# Altium schematic sheet qdr2_3.SchDoc: Virtex-6 QDRs 2 & 3
size A3; Date: DO NOT USE, RATHER USE PROJ OPTIONS; DrawnBy: DO NOT USE, RATHER USE PROJ OPTIONS; Engineer: DO NOT USE, RATHER USE PROJ OPTIONS; Organization: DO NOT USE, RATHER USE PROJ OPTIONS; DocumentNumber: DO NOT USE, RATHER USE PROJ OPTIONS; Revision: DO NOT USE, RATHER USE PROJ OPTIONS; SheetNumber: 20; SheetTotal: 27; SCH_Sheet_Filename: qdr2_3.SchDoc; CurrentTime: DO NOT USE, RATHER USE PROJ OPTIONS; Time: DO NOT USE, RATHER USE PROJ OPTIONS; DocumentFullPathAndName: DO NOT USE, RATHER USE PROJ OPTIONS; DocumentName: DO NOT USE, RATHER USE PROJ OPTIONS; ModifiedDate: DO NOT USE, RATHER USE PROJ OPTIONS; ImagePath: DO NOT USE, RATHER USE PROJ OPTIONS
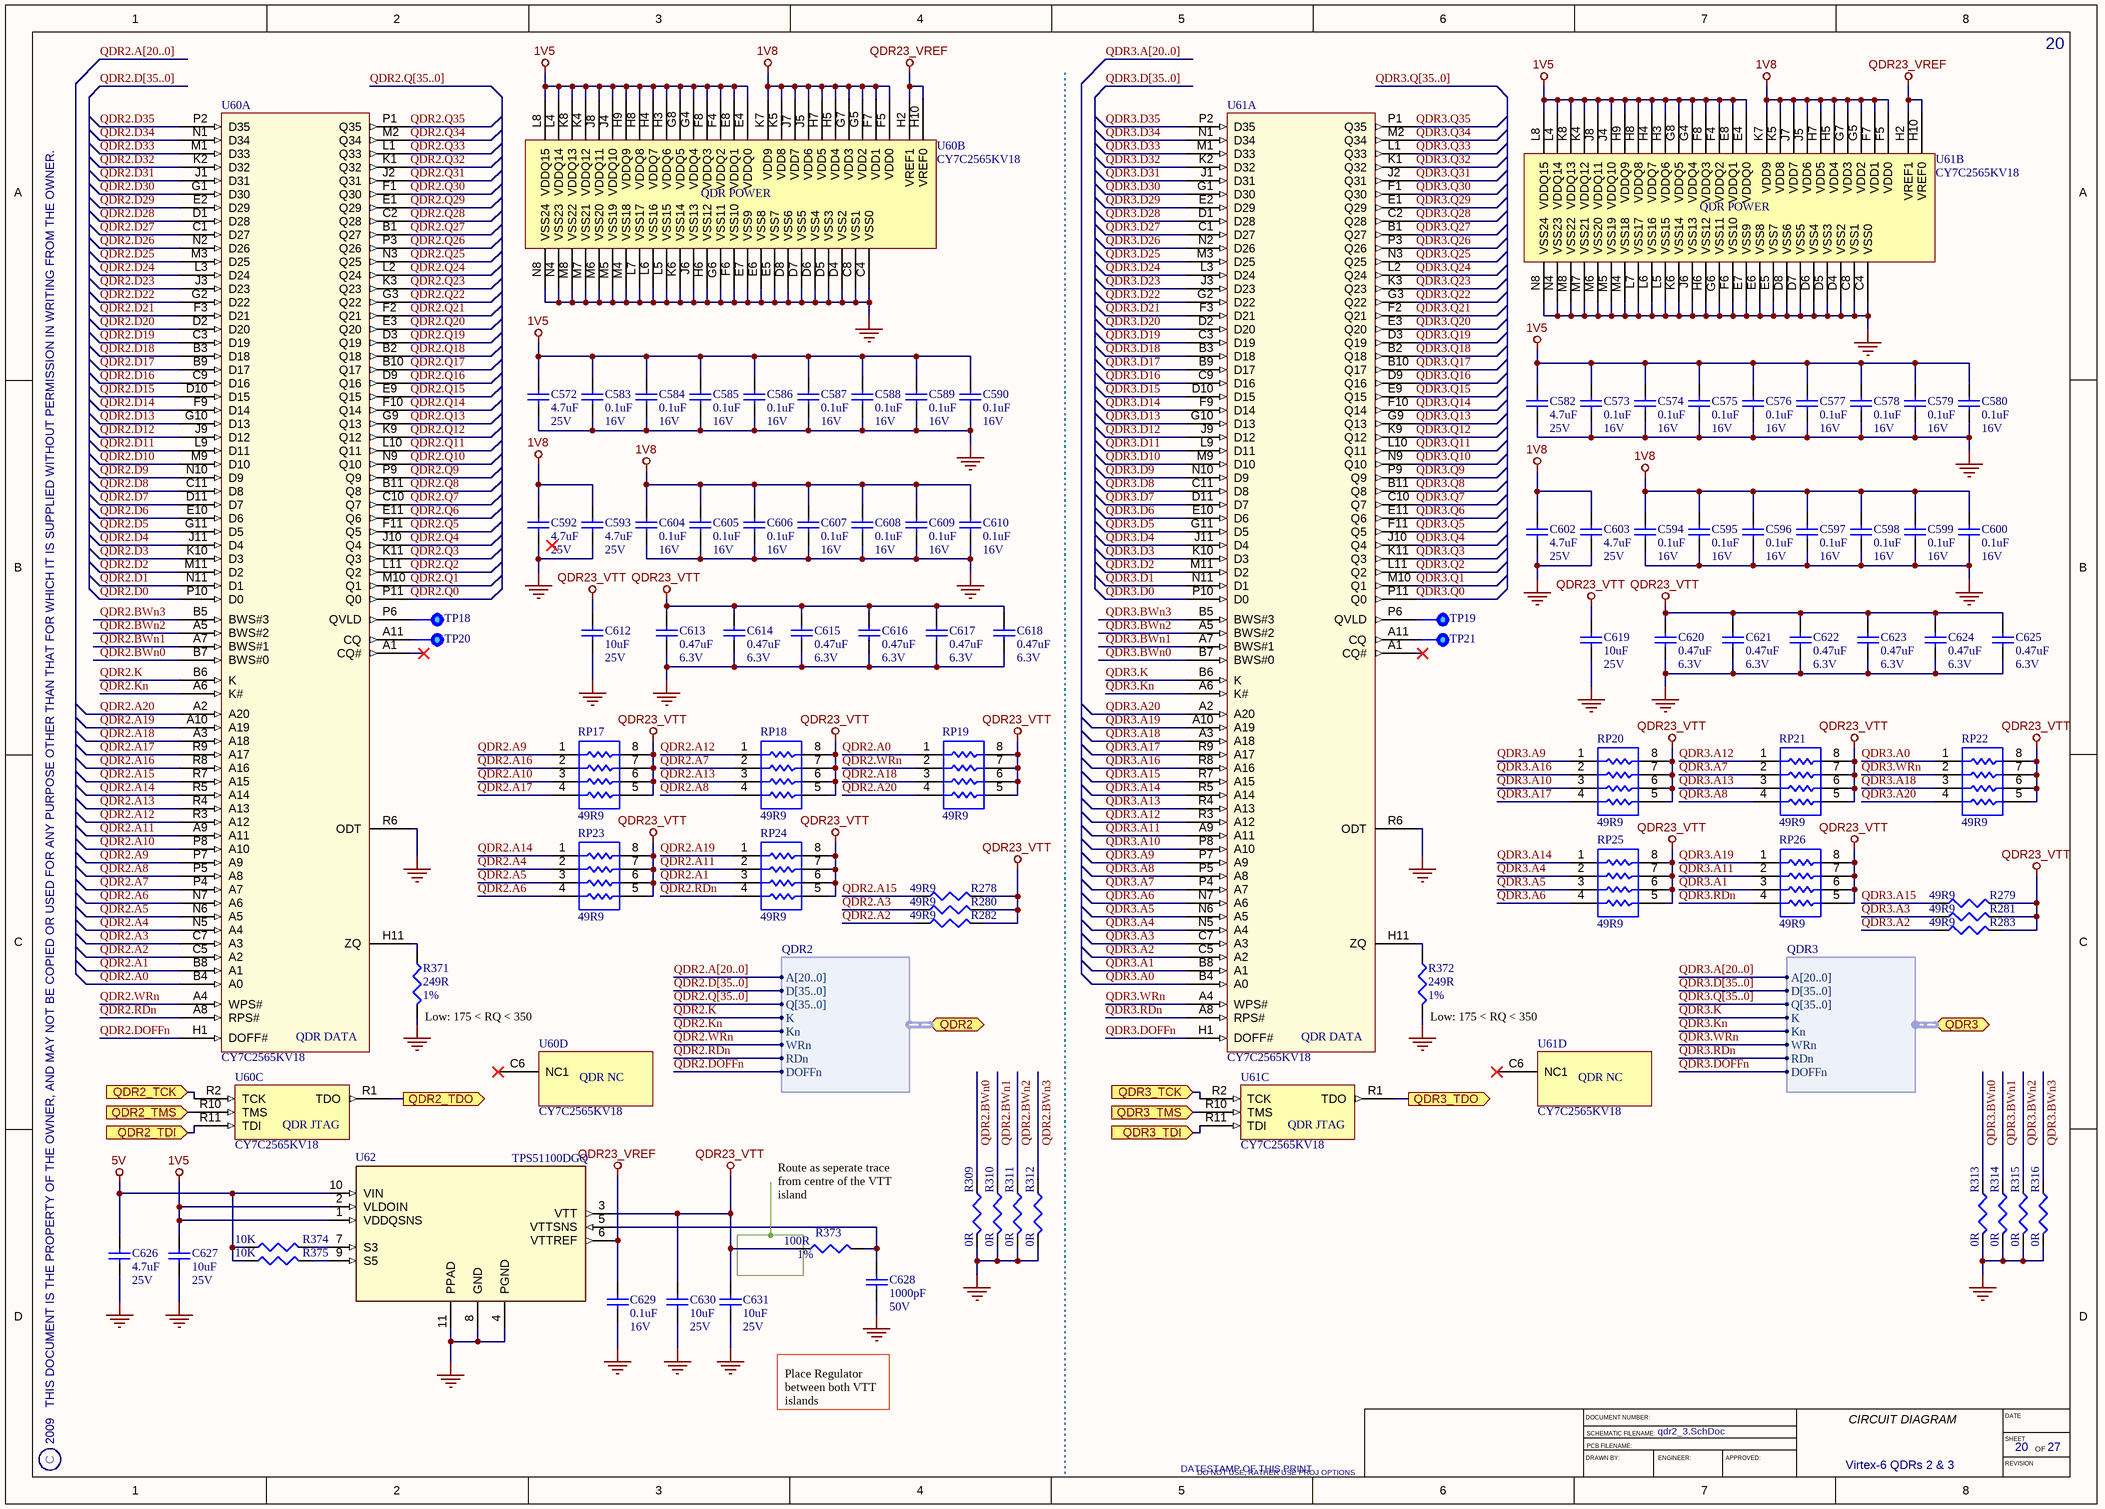
[diagram p0: qdr2_3.SchDoc]

## Parts
C572  Rating: 25V  [CAPC2012X127L]  (hidden comment: 4.7uF)
C573  Rating: 16V  [CAPC1005X60L]  (hidden comment: 0.1uF)
C574  Rating: 16V  [CAPC1005X60L]  (hidden comment: 0.1uF)
C575  Rating: 16V  [CAPC1005X60L]  (hidden comment: 0.1uF)
C576  Rating: 16V  [CAPC1005X60L]  (hidden comment: 0.1uF)
C577  Rating: 16V  [CAPC1005X60L]  (hidden comment: 0.1uF)
C578  Rating: 16V  [CAPC1005X60L]  (hidden comment: 0.1uF)
C579  Rating: 16V  [CAPC1005X60L]  (hidden comment: 0.1uF)
C580  Rating: 16V  [CAPC1005X60L]  (hidden comment: 0.1uF)
C582  Rating: 25V  [CAPC2012X127L]  (hidden comment: 4.7uF)
C583  Rating: 16V  [CAPC1005X60L]  (hidden comment: 0.1uF)
C584  Rating: 16V  [CAPC1005X60L]  (hidden comment: 0.1uF)
C585  Rating: 16V  [CAPC1005X60L]  (hidden comment: 0.1uF)
C586  Rating: 16V  [CAPC1005X60L]  (hidden comment: 0.1uF)
C587  Rating: 16V  [CAPC1005X60L]  (hidden comment: 0.1uF)
C588  Rating: 16V  [CAPC1005X60L]  (hidden comment: 0.1uF)
C589  Rating: 16V  [CAPC1005X60L]  (hidden comment: 0.1uF)
C590  Rating: 16V  [CAPC1005X60L]  (hidden comment: 0.1uF)
C592  Rating: 25V  [CAPC2012X127L]  (hidden comment: 4.7uF)
C593  Rating: 25V  [CAPC2012X127L]  (hidden comment: 4.7uF)
C594  Rating: 16V  [CAPC1005X60L]  (hidden comment: 0.1uF)
C595  Rating: 16V  [CAPC1005X60L]  (hidden comment: 0.1uF)
C596  Rating: 16V  [CAPC1005X60L]  (hidden comment: 0.1uF)
C597  Rating: 16V  [CAPC1005X60L]  (hidden comment: 0.1uF)
C598  Rating: 16V  [CAPC1005X60L]  (hidden comment: 0.1uF)
C599  Rating: 16V  [CAPC1005X60L]  (hidden comment: 0.1uF)
C600  Rating: 16V  [CAPC1005X60L]  (hidden comment: 0.1uF)
C602  Rating: 25V  [CAPC2012X127L]  (hidden comment: 4.7uF)
C603  Rating: 25V  [CAPC2012X127L]  (hidden comment: 4.7uF)
C604  Rating: 16V  [CAPC1005X60L]  (hidden comment: 0.1uF)
C605  Rating: 16V  [CAPC1005X60L]  (hidden comment: 0.1uF)
C606  Rating: 16V  [CAPC1005X60L]  (hidden comment: 0.1uF)
C607  Rating: 16V  [CAPC1005X60L]  (hidden comment: 0.1uF)
C608  Rating: 16V  [CAPC1005X60L]  (hidden comment: 0.1uF)
C609  Rating: 16V  [CAPC1005X60L]  (hidden comment: 0.1uF)
C610  Rating: 16V  [CAPC1005X60L]  (hidden comment: 0.1uF)
C612  Rating: 25V  [CAPC3225X200L]  (hidden comment: 10uF)
C613  Rating: 6.3V  [CAPC1005X55L]  (hidden comment: 0.47uF)
C614  Rating: 6.3V  [CAPC1005X55L]  (hidden comment: 0.47uF)
C615  Rating: 6.3V  [CAPC1005X55L]  (hidden comment: 0.47uF)
C616  Rating: 6.3V  [CAPC1005X55L]  (hidden comment: 0.47uF)
C617  Rating: 6.3V  [CAPC1005X55L]  (hidden comment: 0.47uF)
C618  Rating: 6.3V  [CAPC1005X55L]  (hidden comment: 0.47uF)
C619  Rating: 25V  [CAPC3225X200L]  (hidden comment: 10uF)
C620  Rating: 6.3V  [CAPC1005X55L]  (hidden comment: 0.47uF)
C621  Rating: 6.3V  [CAPC1005X55L]  (hidden comment: 0.47uF)
C622  Rating: 6.3V  [CAPC1005X55L]  (hidden comment: 0.47uF)
C623  Rating: 6.3V  [CAPC1005X55L]  (hidden comment: 0.47uF)
C624  Rating: 6.3V  [CAPC1005X55L]  (hidden comment: 0.47uF)
C625  Rating: 6.3V  [CAPC1005X55L]  (hidden comment: 0.47uF)
C626  Rating: 25V  [CAPC2012X127L]  (hidden comment: 4.7uF)
C627  Rating: 25V  [CAPC3225X200L]  (hidden comment: 10uF)
C628  Rating: 50V  [CAPC1005X55L]  (hidden comment: 1000pF)
C629  Rating: 16V  [CAPC1005X60L]  (hidden comment: 0.1uF)
C630  Rating: 25V  [CAPC3225X200L]  (hidden comment: 10uF)
C631  Rating: 25V  [CAPC3225X200L]  (hidden comment: 10uF)
R278  49R9  [RESC1005X40L]
R279  49R9  [RESC1005X40L]
R280  49R9  [RESC1005X40L]
R281  49R9  [RESC1005X40L]
R282  49R9  [RESC1005X40L]
R283  49R9  [RESC1005X40L]
R309  0R  [RESC1005X40L]
R310  0R  [RESC1005X40L]
R311  0R  [RESC1005X40L]
R312  0R  [RESC1005X40L]
R313  0R  [RESC1005X40L]
R314  0R  [RESC1005X40L]
R315  0R  [RESC1005X40L]
R316  0R  [RESC1005X40L]
R371  Tolerance: 1%  [RESC1005X40L]  (hidden comment: 249R)
R372  Tolerance: 1%  [RESC1005X40L]  (hidden comment: 249R)
R373  Tolerance: 1%  [RESC1005X40L]  (hidden comment: 100R)
R374  10K  [RESC1005X40L]
R375  10K  [RESC1005X40L]
RP17  49R9  [RESCAV50P100X200X45-8L]
RP18  49R9  [RESCAV50P100X200X45-8L]
RP19  49R9  [RESCAV50P100X200X45-8L]
RP20  49R9  [RESCAV50P100X200X45-8L]
RP21  49R9  [RESCAV50P100X200X45-8L]
RP22  49R9  [RESCAV50P100X200X45-8L]
RP23  49R9  [RESCAV50P100X200X45-8L]
RP24  49R9  [RESCAV50P100X200X45-8L]
RP25  49R9  [RESCAV50P100X200X45-8L]
RP26  49R9  [RESCAV50P100X200X45-8L]
TP18  Testpoint  [TP100]  (value not drawn)  (no BOM)
TP19  Testpoint  [TP100]  (value not drawn)  (no BOM)
TP20  Testpoint  [TP100]  (value not drawn)  (no BOM)
TP21  Testpoint  [TP100]  (value not drawn)  (no BOM)
U60  CY7C2565KV18  [FBGA_165-Ball]  (parts A,B,C,D of 4)
U61  CY7C2565KV18  [FBGA_165-Ball]  (parts A,B,C,D of 4)
U62  TPS51100DGQ  [MSOP_10-N]

## Ports
QDR2 (harness QDR2), QDR2_TCK (in), QDR2_TDI (in), QDR2_TDO (out), QDR2_TMS (in), QDR3 (harness QDR3), QDR3_TCK (in), QDR3_TDI (in), QDR3_TDO (out), QDR3_TMS (in)

## Harnesses
QDR2: A[20..0], D[35..0], Q[35..0], K, Kn, WRn, RDn, DOFFn
QDR3: A[20..0], D[35..0], Q[35..0], K, Kn, WRn, RDn, DOFFn

## Nets
1V5: C572.2 C573.2 C574.2 C575.2 C576.2 C577.2 C578.2 C579.2 C580.2 C582.2 C583.2 C584.2 C585.2 C586.2 C587.2 C588.2 C589.2 C590.2 C627.2 U60.E4(VDDQ0) U60.E8(VDDQ1) U60.F4(VDDQ2) U60.F8(VDDQ3) U60.G4(VDDQ4) U60.G8(VDDQ5) U60.H3(VDDQ6) U60.H4(VDDQ7) U60.H8(VDDQ8) U60.H9(VDDQ9) U60.J4(VDDQ10) U60.J8(VDDQ11) U60.K4(VDDQ12) U60.K8(VDDQ13) U60.L4(VDDQ14) U60.L8(VDDQ15) U61.E4(VDDQ0) U61.E8(VDDQ1) U61.F4(VDDQ2) U61.F8(VDDQ3) U61.G4(VDDQ4) U61.G8(VDDQ5) U61.H3(VDDQ6) U61.H4(VDDQ7) U61.H8(VDDQ8) U61.H9(VDDQ9) U61.J4(VDDQ10) U61.J8(VDDQ11) U61.K4(VDDQ12) U61.K8(VDDQ13) U61.L4(VDDQ14) U61.L8(VDDQ15) U62.1(VDDQSNS) U62.2(VLDOIN)
1V8: C592.2 C593.2 C594.2 C595.2 C596.2 C597.2 C598.2 C599.2 C600.2 C602.2 C603.2 C604.2 C605.2 C606.2 C607.2 C608.2 C609.2 C610.2 U60.F5(VDD0) U60.F7(VDD1) U60.G5(VDD2) U60.G7(VDD3) U60.H5(VDD4) U60.H7(VDD5) U60.J5(VDD6) U60.J7(VDD7) U60.K5(VDD8) U60.K7(VDD9) U61.F5(VDD0) U61.F7(VDD1) U61.G5(VDD2) U61.G7(VDD3) U61.H5(VDD4) U61.H7(VDD5) U61.J5(VDD6) U61.J7(VDD7) U61.K5(VDD8) U61.K7(VDD9)
5V: C626.2 R374.1 R375.1 U62.10(VIN)
GND: C572.1 C573.1 C574.1 C575.1 C576.1 C577.1 C578.1 C579.1 C580.1 C582.1 C583.1 C584.1 C585.1 C586.1 C587.1 C588.1 C589.1 C590.1 C592.1 C593.1 C594.1 C595.1 C596.1 C597.1 C598.1 C599.1 C600.1 C602.1 C603.1 C604.1 C605.1 C606.1 C607.1 C608.1 C609.1 C610.1 C612.1 C613.1 C614.1 C615.1 C616.1 C617.1 C618.1 C619.1 C620.1 C621.1 C622.1 C623.1 C624.1 C625.1 C626.1 C627.1 C628.1 C629.1 C630.1 C631.1 R309.2 R310.2 R311.2 R312.2 R313.2 R314.2 R315.2 R316.2 R371.2 R372.2 U60.C4(VSS0) U60.C8(VSS1) U60.D4(VSS2) U60.D5(VSS3) U60.D6(VSS4) U60.D7(VSS5) U60.D8(VSS6) U60.E5(VSS7) U60.E6(VSS8) U60.E7(VSS9) U60.F6(VSS10) U60.G6(VSS11) U60.H6(VSS12) U60.J6(VSS13) U60.K6(VSS14) U60.L5(VSS15) U60.L6(VSS16) U60.L7(VSS17) U60.M4(VSS18) U60.M5(VSS19) U60.M6(VSS20) U60.M7(VSS21) U60.M8(VSS22) U60.N4(VSS23) U60.N8(VSS24) U60.R6(ODT) U61.C4(VSS0) U61.C8(VSS1) U61.D4(VSS2) U61.D5(VSS3) U61.D6(VSS4) U61.D7(VSS5) U61.D8(VSS6) U61.E5(VSS7) U61.E6(VSS8) U61.E7(VSS9) U61.F6(VSS10) U61.G6(VSS11) U61.H6(VSS12) U61.J6(VSS13) U61.K6(VSS14) U61.L5(VSS15) U61.L6(VSS16) U61.L7(VSS17) U61.M4(VSS18) U61.M5(VSS19) U61.M6(VSS20) U61.M7(VSS21) U61.M8(VSS22) U61.N4(VSS23) U61.N8(VSS24) U61.R6(ODT) U62.4(PGND) U62.8(GND) U62.11(PPAD)
QDR23_VREF: C629.2 U60.H2(VREF1) U60.H10(VREF0) U61.H2(VREF1) U61.H10(VREF0) U62.6(VTTREF)
QDR23_VTT: C612.2 C613.2 C614.2 C615.2 C616.2 C617.2 C618.2 C619.2 C620.2 C621.2 C622.2 C623.2 C624.2 C625.2 C630.2 C631.2 R278.2 R279.2 R280.2 R281.2 R282.2 R283.2 R373.1 RP17.5 RP17.6 RP17.7 RP17.8 RP18.5 RP18.6 RP18.7 RP18.8 RP19.5 RP19.6 RP19.7 RP19.8 RP20.5 RP20.6 RP20.7 RP20.8 RP21.5 RP21.6 RP21.7 RP21.8 RP22.5 RP22.6 RP22.7 RP22.8 RP23.5 RP23.6 RP23.7 RP23.8 RP24.5 RP24.6 RP24.7 RP24.8 RP25.5 RP25.6 RP25.7 RP25.8 RP26.5 RP26.6 RP26.7 RP26.8 U62.3(VTT)
QDR2.A0: RP19.1 U60.B4(A0)
QDR2.A1: RP24.3 U60.B8(A1)
QDR2.A2: R282.1 U60.C5(A2)
QDR2.A3: R280.1 U60.C7(A3)
QDR2.A4: RP23.2 U60.N5(A4)
QDR2.A5: RP23.3 U60.N6(A5)
QDR2.A6: RP23.4 U60.N7(A6)
QDR2.A7: RP18.2 U60.P4(A7)
QDR2.A8: RP18.4 U60.P5(A8)
QDR2.A9: RP17.1 U60.P7(A9)
QDR2.A10: RP17.3 U60.P8(A10)
QDR2.A11: RP24.2 U60.A9(A11)
QDR2.A12: RP18.1 U60.R3(A12)
QDR2.A13: RP18.3 U60.R4(A13)
QDR2.A14: RP23.1 U60.R5(A14)
QDR2.A15: R278.1 U60.R7(A15)
QDR2.A16: RP17.2 U60.R8(A16)
QDR2.A17: RP17.4 U60.R9(A17)
QDR2.A18: RP19.3 U60.A3(A18)
QDR2.A19: RP24.1 U60.A10(A19)
QDR2.A20: RP19.4 U60.A2(A20)
QDR2.BWn0: R309.1 U60.B7(BWS#0)
QDR2.BWn1: R310.1 U60.A7(BWS#1)
QDR2.BWn2: R311.1 U60.A5(BWS#2)
QDR2.BWn3: R312.1 U60.B5(BWS#3)
QDR2.D0: U60.P10(D0)
QDR2.D1: U60.N11(D1)
QDR2.D2: U60.M11(D2)
QDR2.D3: U60.K10(D3)
QDR2.D4: U60.J11(D4)
QDR2.D5: U60.G11(D5)
QDR2.D6: U60.E10(D6)
QDR2.D7: U60.D11(D7)
QDR2.D8: U60.C11(D8)
QDR2.D9: U60.N10(D9)
QDR2.D10: U60.M9(D10)
QDR2.D11: U60.L9(D11)
QDR2.D12: U60.J9(D12)
QDR2.D13: U60.G10(D13)
QDR2.D14: U60.F9(D14)
QDR2.D15: U60.D10(D15)
QDR2.D16: U60.C9(D16)
QDR2.D17: U60.B9(D17)
QDR2.D18: U60.B3(D18)
QDR2.D19: U60.C3(D19)
QDR2.D20: U60.D2(D20)
QDR2.D21: U60.F3(D21)
QDR2.D22: U60.G2(D22)
QDR2.D23: U60.J3(D23)
QDR2.D24: U60.L3(D24)
QDR2.D25: U60.M3(D25)
QDR2.D26: U60.N2(D26)
QDR2.D27: U60.C1(D27)
QDR2.D28: U60.D1(D28)
QDR2.D29: U60.E2(D29)
QDR2.D30: U60.G1(D30)
QDR2.D31: U60.J1(D31)
QDR2.D32: U60.K2(D32)
QDR2.D33: U60.M1(D33)
QDR2.D34: U60.N1(D34)
QDR2.D35: U60.P2(D35)
QDR2.DOFFn: U60.H1(DOFF#) ; port QDR2.DOFFn
QDR2.K: U60.B6(K) ; port QDR2.K
QDR2.Kn: U60.A6(K#) ; port QDR2.Kn
QDR2.Q0: U60.P11(Q0)
QDR2.Q1: U60.M10(Q1)
QDR2.Q2: U60.L11(Q2)
QDR2.Q3: U60.K11(Q3)
QDR2.Q4: U60.J10(Q4)
QDR2.Q5: U60.F11(Q5)
QDR2.Q6: U60.E11(Q6)
QDR2.Q7: U60.C10(Q7)
QDR2.Q8: U60.B11(Q8)
QDR2.Q9: U60.P9(Q9)
QDR2.Q10: U60.N9(Q10)
QDR2.Q11: U60.L10(Q11)
QDR2.Q12: U60.K9(Q12)
QDR2.Q13: U60.G9(Q13)
QDR2.Q14: U60.F10(Q14)
QDR2.Q15: U60.E9(Q15)
QDR2.Q16: U60.D9(Q16)
QDR2.Q17: U60.B10(Q17)
QDR2.Q18: U60.B2(Q18)
QDR2.Q19: U60.D3(Q19)
QDR2.Q20: U60.E3(Q20)
QDR2.Q21: U60.F2(Q21)
QDR2.Q22: U60.G3(Q22)
QDR2.Q23: U60.K3(Q23)
QDR2.Q24: U60.L2(Q24)
QDR2.Q25: U60.N3(Q25)
QDR2.Q26: U60.P3(Q26)
QDR2.Q27: U60.B1(Q27)
QDR2.Q28: U60.C2(Q28)
QDR2.Q29: U60.E1(Q29)
QDR2.Q30: U60.F1(Q30)
QDR2.Q31: U60.J2(Q31)
QDR2.Q32: U60.K1(Q32)
QDR2.Q33: U60.L1(Q33)
QDR2.Q34: U60.M2(Q34)
QDR2.Q35: U60.P1(Q35)
QDR2.RDn: RP24.4 U60.A8(RPS#) ; port QDR2.RDn
QDR2.WRn: RP19.2 U60.A4(WPS#) ; port QDR2.WRn
QDR2_TCK: U60.R2(TCK) ; port QDR2_TCK
QDR2_TDI: U60.R11(TDI) ; port QDR2_TDI
QDR2_TDO: U60.R1(TDO) ; port QDR2_TDO
QDR2_TMS: U60.R10(TMS) ; port QDR2_TMS
QDR3.A0: RP22.1 U61.B4(A0)
QDR3.A1: RP26.3 U61.B8(A1)
QDR3.A2: R283.1 U61.C5(A2)
QDR3.A3: R281.1 U61.C7(A3)
QDR3.A4: RP25.2 U61.N5(A4)
QDR3.A5: RP25.3 U61.N6(A5)
QDR3.A6: RP25.4 U61.N7(A6)
QDR3.A7: RP21.2 U61.P4(A7)
QDR3.A8: RP21.4 U61.P5(A8)
QDR3.A9: RP20.1 U61.P7(A9)
QDR3.A10: RP20.3 U61.P8(A10)
QDR3.A11: RP26.2 U61.A9(A11)
QDR3.A12: RP21.1 U61.R3(A12)
QDR3.A13: RP21.3 U61.R4(A13)
QDR3.A14: RP25.1 U61.R5(A14)
QDR3.A15: R279.1 U61.R7(A15)
QDR3.A16: RP20.2 U61.R8(A16)
QDR3.A17: RP20.4 U61.R9(A17)
QDR3.A18: RP22.3 U61.A3(A18)
QDR3.A19: RP26.1 U61.A10(A19)
QDR3.A20: RP22.4 U61.A2(A20)
QDR3.BWn0: R313.1 U61.B7(BWS#0)
QDR3.BWn1: R314.1 U61.A7(BWS#1)
QDR3.BWn2: R315.1 U61.A5(BWS#2)
QDR3.BWn3: R316.1 U61.B5(BWS#3)
QDR3.D0: U61.P10(D0)
QDR3.D1: U61.N11(D1)
QDR3.D2: U61.M11(D2)
QDR3.D3: U61.K10(D3)
QDR3.D4: U61.J11(D4)
QDR3.D5: U61.G11(D5)
QDR3.D6: U61.E10(D6)
QDR3.D7: U61.D11(D7)
QDR3.D8: U61.C11(D8)
QDR3.D9: U61.N10(D9)
QDR3.D10: U61.M9(D10)
QDR3.D11: U61.L9(D11)
QDR3.D12: U61.J9(D12)
QDR3.D13: U61.G10(D13)
QDR3.D14: U61.F9(D14)
QDR3.D15: U61.D10(D15)
QDR3.D16: U61.C9(D16)
QDR3.D17: U61.B9(D17)
QDR3.D18: U61.B3(D18)
QDR3.D19: U61.C3(D19)
QDR3.D20: U61.D2(D20)
QDR3.D21: U61.F3(D21)
QDR3.D22: U61.G2(D22)
QDR3.D23: U61.J3(D23)
QDR3.D24: U61.L3(D24)
QDR3.D25: U61.M3(D25)
QDR3.D26: U61.N2(D26)
QDR3.D27: U61.C1(D27)
QDR3.D28: U61.D1(D28)
QDR3.D29: U61.E2(D29)
QDR3.D30: U61.G1(D30)
QDR3.D31: U61.J1(D31)
QDR3.D32: U61.K2(D32)
QDR3.D33: U61.M1(D33)
QDR3.D34: U61.N1(D34)
QDR3.D35: U61.P2(D35)
QDR3.DOFFn: U61.H1(DOFF#) ; port QDR3.DOFFn
QDR3.K: U61.B6(K) ; port QDR3.K
QDR3.Kn: U61.A6(K#) ; port QDR3.Kn
QDR3.Q0: U61.P11(Q0)
QDR3.Q1: U61.M10(Q1)
QDR3.Q2: U61.L11(Q2)
QDR3.Q3: U61.K11(Q3)
QDR3.Q4: U61.J10(Q4)
QDR3.Q5: U61.F11(Q5)
QDR3.Q6: U61.E11(Q6)
QDR3.Q7: U61.C10(Q7)
QDR3.Q8: U61.B11(Q8)
QDR3.Q9: U61.P9(Q9)
QDR3.Q10: U61.N9(Q10)
QDR3.Q11: U61.L10(Q11)
QDR3.Q12: U61.K9(Q12)
QDR3.Q13: U61.G9(Q13)
QDR3.Q14: U61.F10(Q14)
QDR3.Q15: U61.E9(Q15)
QDR3.Q16: U61.D9(Q16)
QDR3.Q17: U61.B10(Q17)
QDR3.Q18: U61.B2(Q18)
QDR3.Q19: U61.D3(Q19)
QDR3.Q20: U61.E3(Q20)
QDR3.Q21: U61.F2(Q21)
QDR3.Q22: U61.G3(Q22)
QDR3.Q23: U61.K3(Q23)
QDR3.Q24: U61.L2(Q24)
QDR3.Q25: U61.N3(Q25)
QDR3.Q26: U61.P3(Q26)
QDR3.Q27: U61.B1(Q27)
QDR3.Q28: U61.C2(Q28)
QDR3.Q29: U61.E1(Q29)
QDR3.Q30: U61.F1(Q30)
QDR3.Q31: U61.J2(Q31)
QDR3.Q32: U61.K1(Q32)
QDR3.Q33: U61.L1(Q33)
QDR3.Q34: U61.M2(Q34)
QDR3.Q35: U61.P1(Q35)
QDR3.RDn: RP26.4 U61.A8(RPS#) ; port QDR3.RDn
QDR3.WRn: RP22.2 U61.A4(WPS#) ; port QDR3.WRn
QDR3_TCK: U61.R2(TCK) ; port QDR3_TCK
QDR3_TDI: U61.R11(TDI) ; port QDR3_TDI
QDR3_TDO: U61.R1(TDO) ; port QDR3_TDO
QDR3_TMS: U61.R10(TMS) ; port QDR3_TMS
NetC628_2: C628.2 R373.2 U62.5(VTTSNS)
NetR371_1: R371.1 U60.H11(ZQ)
NetR372_1: R372.1 U61.H11(ZQ)
NetR374_2: R374.2 U62.7(S3)
NetR375_2: R375.2 U62.9(S5)
NetTP18_1: TP18.1 U60.P6(QVLD)
NetTP19_1: TP19.1 U61.P6(QVLD)
NetTP20_1: TP20.1 U60.A11(CQ)
NetTP21_1: TP21.1 U61.A11(CQ)

Not connected (* = marked no-connect by the designer): U60 A1(CQ#)* C6(NC1)*; U61 A1(CQ#)* C6(NC1)*

## Buses and harness runs
bus QDR2.A[20..0]
bus QDR2.D[35..0]
bus QDR2.Q[35..0]
bus QDR3.A[20..0]
bus QDR3.D[35..0]
bus QDR3.Q[35..0]

## Notes on the sheet
- (near R371) Low: 175 < RQ < 350
- (near R372) Low: 175 < RQ < 350
- Route as seperate trace from centre of the VTT island
- Place Regulator between both VTT islands
- 2009   THIS DOCUMENT IS THE PROPERTY OF THE OWNER, AND MAY NOT BE COPIED OR USED FOR ANY PURPOSE OTHER THAN THAT FOR WHICH IT IS SUPPLIED WITHOUT PERMISSION IN WRITING FROM THE OWNER.
- C
- DATESTAMP OF THIS PRINT
- DRAWN BY:
- DOCUMENT NUMBER:
- SCHEMATIC FILENAME:
- PCB FILENAME:
- ENGINEER:
- APPROVED:
- CIRCUIT DIAGRAM
- DATE
- SHEET
- REVISION
- OF
- (in symbol IC-MEM-1, part A) QDR DATA
- (in symbol IC-MEM-1, part B) QDR POWER
- (in symbol IC-MEM-1, part C) QDR JTAG
- (in symbol IC-MEM-1, part D) QDR NC

## Library data of the parts
C572 C582 C592 C593 C602 C603 C626 = CAP-CER-3: 4.7uF, Ceramic Capacitor; Manufacturer: MURATA; PartNum: GRM21BR61E475KA12K; Tolerance: 10%; Dielectric: X5R; POD number: CAP-CER-3; Value: 4.7uF; RoHS: Y; Sort Value: 4.7; Category: Capacitors; Subcategory: Ceramic
C573-C580 C583-C590 C594-C600 C604-C610 C629 = CAP-CER-1: 0.1uF, Ceramic Capacitor; Manufacturer: VENKEL; PartNum: C0402X7R160-104KN; Tolerance: 10%; Dielectric: X7R; POD number: CAP-CER-1; Value: 0.1uF; RoHS: Y; Sort Value: 0.1; Category: Capacitors; Subcategory: Ceramic
C612 C619 C627 C630 C631 = CAP-CER-5: 10uF, Ceramic Capacitor; Manufacturer: MURATA; PartNum: GRM32DR61E106KA12L; Tolerance: 10%; Dielectric: X5R; POD number: CAP-CER-5; Value: 10uF; RoHS: Y; Sort Value: 100; Category: Capacitors; Subcategory: Ceramic
C613-C618 C620-C625 = CAP-CER-7: 0.47uF, Ceramic Capacitor; Manufacturer: MURATA; PartNum: GRM155R60J474KE19; Tolerance: 10%; Dielectric: X5R; POD number: CAP-CER-7; Value: 0.47uF; RoHS: Y; Sort Value: 0.47; Category: Capacitors; Subcategory: Ceramic
C628 = CAP-CER-4: 1000pF, Ceramic Capacitor; Manufacturer: MURATA; PartNum: GRM155R61H102KA01D; Tolerance: 10%; Dielectric: X5R; POD number: CAP-CER-4; Value: 1000pF; RoHS: Y; Sort Value: 0.0001; Category: Capacitors; Subcategory: Ceramic
R278-R283 = RES-TF-10: 49R9, 1.1mm x 0.5mm, Thick Film Resistor; Manufacturer: ROYALOHM; PartNum: 0402WGF499JT1E; Tolerance: 1%; Rating: 0.0625W; POD number: RES-TF-10; Value: 49R9; Sort Value: 49.9; Category: Resistors; Subcategory: ThickFilm; HelpURL: *.pdf
R309-R316 = RES-TF-0: 0R, 1.1mm x 0.5mm, Thick Film Resistor; Manufacturer: ROYALOHM; PartNum: 0402WG00000T1E; Tolerance: 0%; Rating: 0.0625W; POD number: RES-TF-0; Value: 0R; Sort Value: 0; Category: Resistors; Subcategory: ThickFilm; HelpURL: *.pdf
R371 R372 = RES-TF-15: 249R, 1.1mm x 0.5mm, Thick Film Resistor; Manufacturer: ROYALOHM; PartNum: 0402WGF2490T1E; Rating: 0.0625W; POD number: RES-TF-15; Value: 249R; Sort Value: 249; Category: Resistors; Subcategory: ThickFilm; HelpURL: *.pdf
R373 = RES-TF-14: 100R, 1.1mm x 0.5mm, Thick Film Resistor; Manufacturer: ROYALOHM; PartNum: 0402WGF0101T1E; Rating: 0.0625W; POD number: RES-TF-14; Value: 100R; Sort Value: 1000; Category: Resistors; Subcategory: ThickFilm; HelpURL: *.pdf
R374 R375 = RES-TF-5: 10K, 1.1mm x 0.5mm, Thick Film Resistor; Manufacturer: ROYALOHM; PartNum: 0402WGJ0103T1E; Tolerance: 5%; Rating: 0.0625W; POD number: RES-TF-5; Value: 10K; Sort Value: 10000; Category: Resistors; Subcategory: ThickFilm; HelpURL: *.pdf
RP17-RP26 = RES-TF-39: 4-Wide, Isolated, Thick Film Resistor Network; Manufacturer: ROYALOHM; PartNum: 4D02WGJ0510B1E; Tolerance: 1%; Rating: 0.0625W; POD number: RES-TF-39; Value: 49R9; Sort Value: 49.9; Category: Resistors; Subcategory: ThickFilm
TP18-TP21 = ELMECH-TP-0: 1mm Diameter, through-hole, Circular Test-point; POD number: ELMECH-TP-0; RoHS: Y; Category: ELMECH; Subcategory: Test Points
U60 U61 = IC-MEM-1: 72Mb, 36-Bit wide, QDR2+ Synchronous SRAM with ODT; Manufacturer: Cypress; PartNum: CY7C2565KV18-450BZXC; POD number: IC-MEM-1; RoHS: Y; Category: IC; Subcategory: Memory
U62 = IC-REG-6: 3A Sink/Source Regulator; Manufacturer: Texas Instruments; POD number: IC-REG-6; PartNum: TPS51100DGQ; RoHS: Y; Category: IC; Subcategory: Regulators